# Altium schematic sheet Anolog Input.SchDoc
size A2
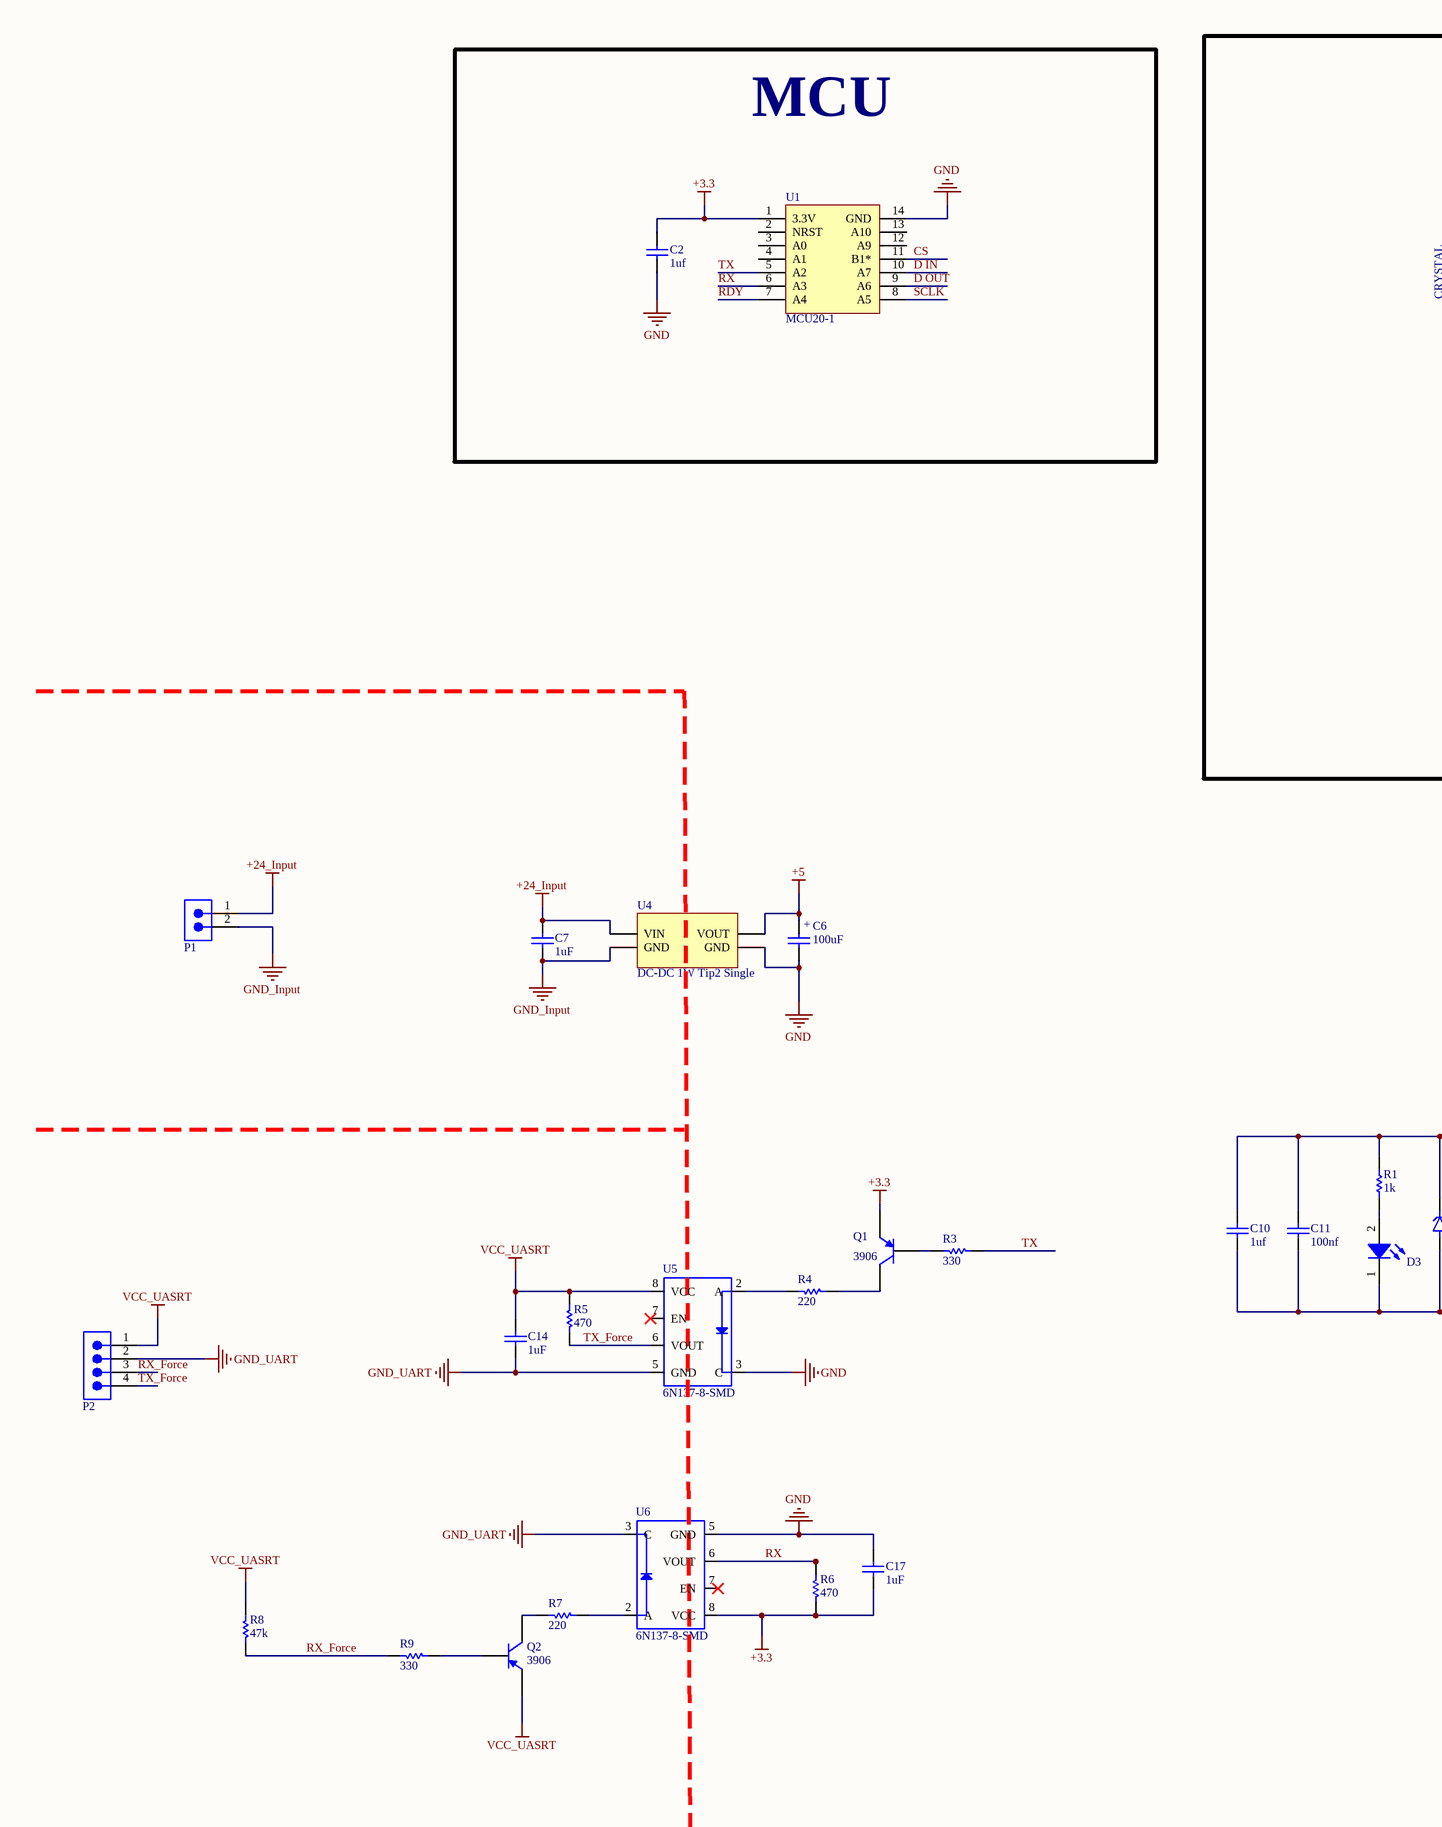
[diagram p0: Anolog Input.SchDoc, left]
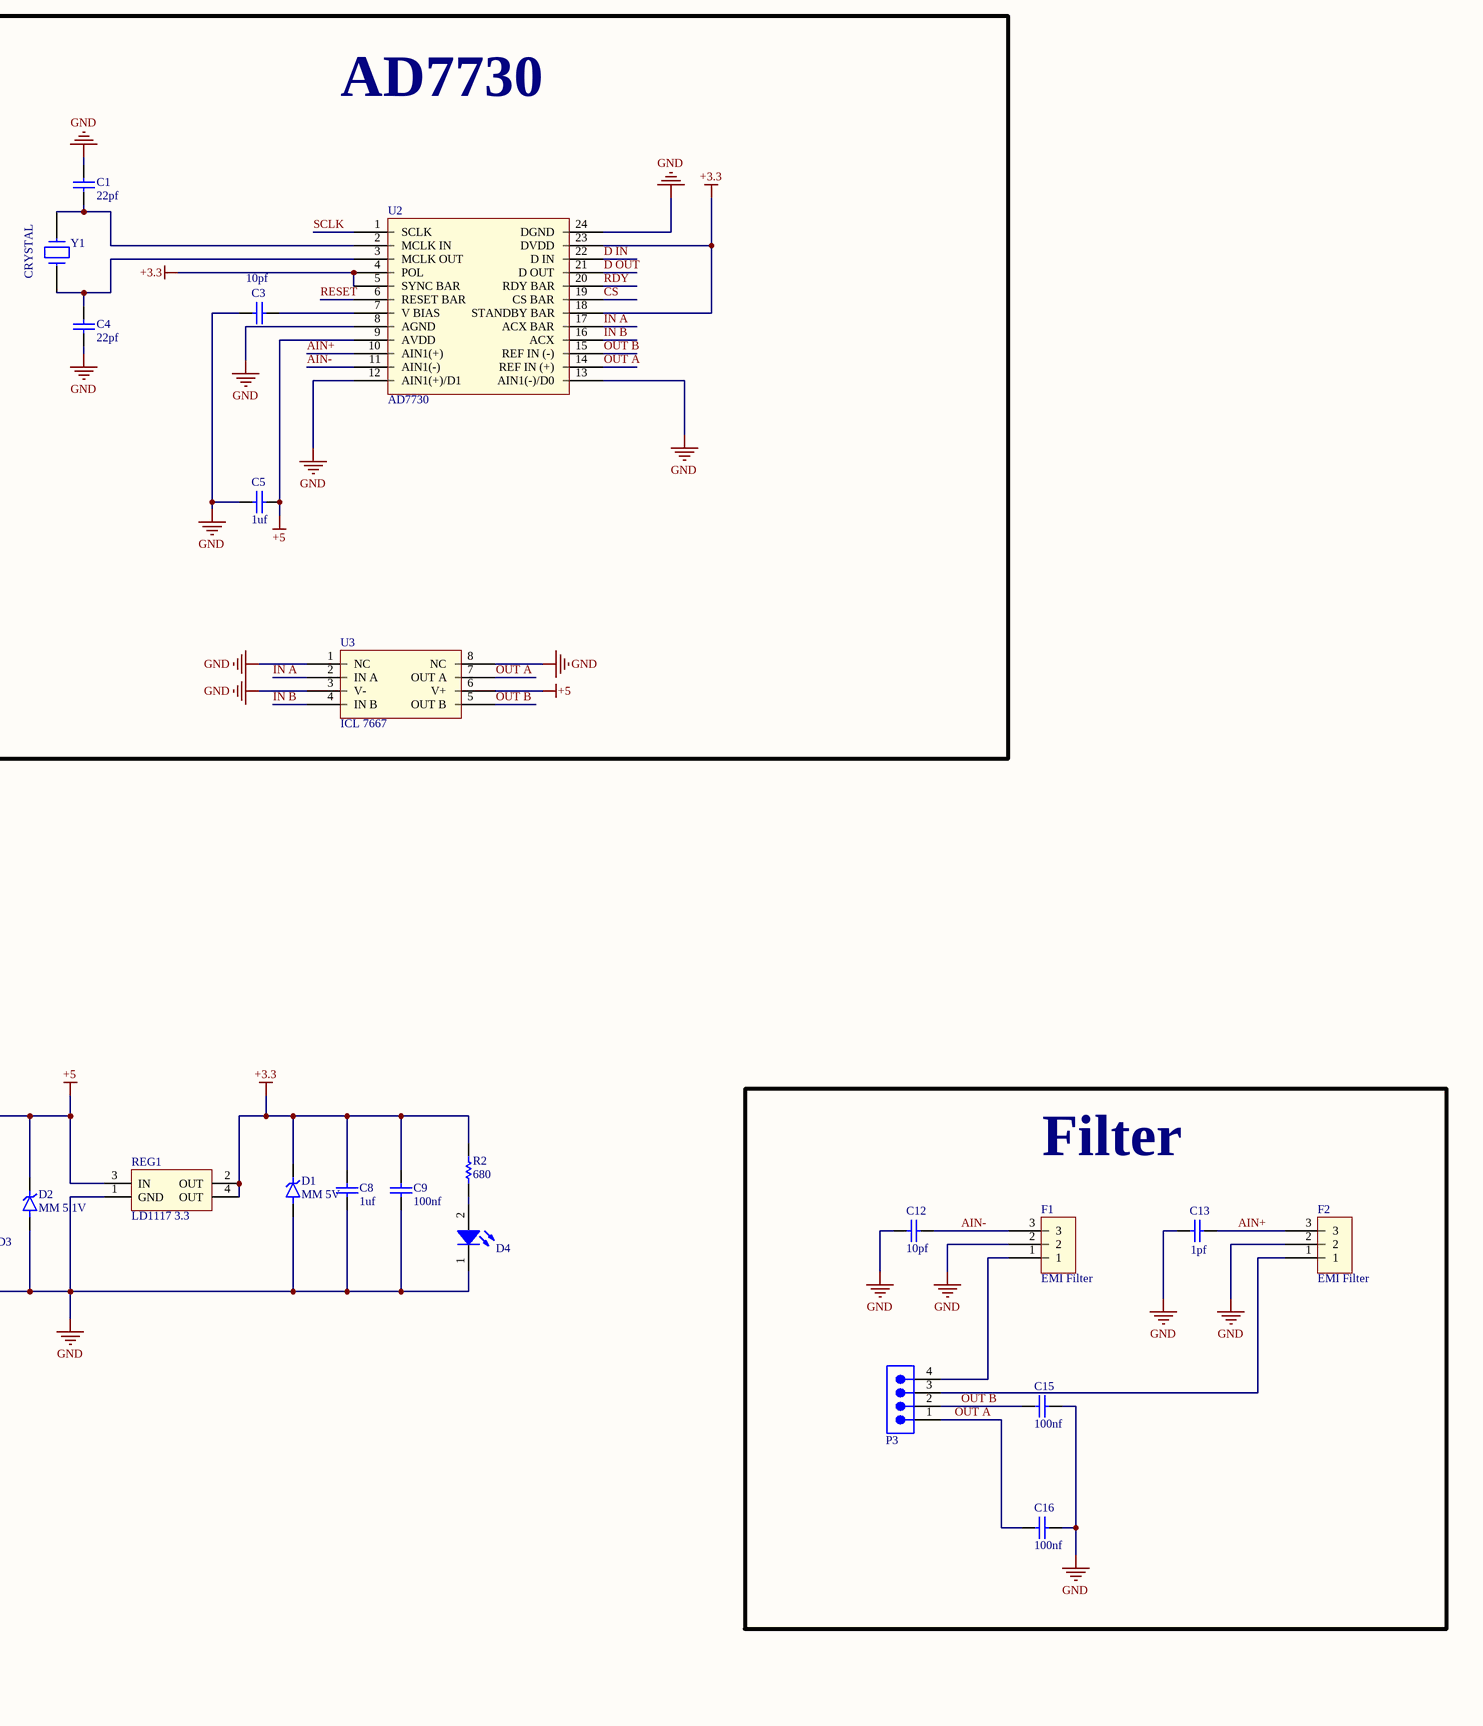
[diagram p1: Anolog Input.SchDoc, right]

## Parts
C1  22pf  [SMD 805 CAP]
C2  1uf  [SMD 805 CAP]
C3  10pf  [SMD 805 CAP]
C4  22pf  [SMD 805 CAP]
C5  1uf  [SMD 805 CAP]
C6  100uF  [MY_CAP_POL 6MM]
C7  1uF  [SMD 805 CAP]
C8  1uf  [SMD 805 CAP]
C9  100nf  [SMD 805 CAP]
C10  1uf  [SMD 805 CAP]
C11  100nf  [SMD 805 CAP]
C12  10pf  [SMD 805 CAP]
C13  1pf  [SMD 805 CAP]
C14  1uF  [SMD 805 CAP]
C15  100nf  [SMD 805 CAP]
C16  100nf  [SMD 805 CAP]
C17  1uF  [SMD 805 CAP]
D1  MM 5V  [MiniMelf]
D2  MM 5.1V  [MiniMelf]
D3  LED_SMD_0805  [LED_0805]  (value not drawn)
D4  LED_SMD_0805  [LED_0805]  (value not drawn)
F1  EMI Filter  [EMI FILTER]
F2  EMI Filter  [EMI FILTER]
P1  691312510002  [691312510002]  (value not drawn)
P2  691312510004  [691312510004]  (value not drawn)
P3  61300411121  [61300411121]  (value not drawn)
Q1  3906  [MY_SMD_TRANSISTOR]
Q2  3906  [MY_SMD_TRANSISTOR]
R1  1k  [SMD 805]
R2  680  [SMD 805]
R3  330  [SMD 805]
R4  220  [SMD 805]
R5  470  [SMD 805]
R6  470  [SMD 805]
R7  220  [SMD 805]
R8  47k  [SMD 805]
R9  330  [SMD 805]
REG1  LD1117 3.3  [MY_LD1117-3.3]
U1  MCU20-1  [MCU20-1]
U2  AD7730  [PDIP 24]
U3  ICL 7667  [SOIC 8]
U4  DC-DC 1W Tip2 Single  [DC-DC-1W-Tip2]
U5  6N137-8-SMD  [6N137-8-SMD]
U6  6N137-8-SMD  [6N137-8-SMD]
Y1  CRYSTAL  [My_Crystal]

## Blocks framed on the sheet
MCU: C2 U1
AD7730: C1 C3-C5 U2 U3 Y1
Filter: C12 C13 C15 C16 F1 F2 P3

## Nets
+3.3: C2.1 C8.2 C9.2 C17.2 D1.2 Q1.E R2.2 R6.2 REG1.2(OUT) REG1.4(OUT) U1.1(3.3V) U2.4(POL) U2.5(SYNC_BAR) U2.18(STANDBY_BAR) U2.23(DVDD) U6.8(VCC)
+5: C5.1 C6.+ C10.2 C11.2 D2.2 R1.2 REG1.3(IN) U2.9(AVDD) U3.6(V+) U4.7(VOUT)
+24_Input: C7.2 P1.1 U4.1(VIN)
GND: C1.1 C2.2 C3.2 C4.2 C5.2 C6.- C8.1 C9.1 C10.1 C11.1 C12.1 C13.1 C15.1 C16.1 C17.1 D1.1 D2.1 D3.1(K) D4.1(K) F1.2 F2.2 REG1.1(GND) U1.14(GND) U2.8(AGND) U2.12(AIN1(+)/D1) U2.13(AIN1(-)/D0) U2.24(DGND) U3.1(NC) U3.3(V-) U3.8(NC) U4.5(GND) U5.3(C) U6.5(GND)
GND_Input: C7.1 P1.2 U4.2(GND)
GND_UART: C14.1 P2.2 U5.5(GND) U6.3(C)
VCC_UASRT: C14.2 P2.1 Q2.E R5.2 R8.2 U5.8(VCC)
AIN+: C13.2 F2.3 U2.10(AIN1(+))
AIN-: C12.2 F1.3 U2.11(AIN1(-))
CS: U1.11(B1*) U2.19(CS_BAR)
D IN: U1.10(A7) U2.22(D_IN)
D OUT: U1.9(A6) U2.21(D_OUT)
IN A: U2.17(ACX_BAR) U3.2(IN_A)
IN B: U2.16(ACX) U3.4(IN_B)
OUT A: C16.2 P3.1 U2.14(REF_IN_(+)) U3.7(OUT_A)
OUT B: C15.2 P3.2 U2.15(REF_IN_(-)) U3.5(OUT_B)
RDY: U1.7(A4) U2.20(RDY_BAR)
RESET: U2.6(RESET_BAR)
RX: R6.1 U1.6(A3) U6.6(VOUT)
RX_Force: P2.3 R8.1 R9.2
SCLK: U1.8(A5) U2.1(SCLK)
TX: R3.1 U1.5(A2)
TX_Force: P2.4 R5.1 U5.6(VOUT)
NetC1_2: C1.2 U2.2(MCLK_IN) Y1.1
NetC3_1: C3.1 U2.7(V_BIAS)
NetC4_1: C4.1 U2.3(MCLK_OUT) Y1.2
NetD3_2: D3.2(A) R1.1
NetD4_2: D4.2(A) R2.1
NetF1_1: F1.1 P3.4
NetF2_1: F2.1 P3.3
NetQ1_B: Q1.B R3.2
NetQ1_C: Q1.C R4.1
NetQ2_B: Q2.B R9.1
NetQ2_C: Q2.C R7.2
NetR4_2: R4.2 U5.2(A)
NetR7_1: R7.1 U6.2(A)

Not connected (* = marked no-connect by the designer): U1 2(NRST) 3(A0) 4(A1) 12(A9) 13(A10); U5 7(EN)*; U6 7(EN)*

## Library data of the parts
C1 C4 = CAP B: 1uf
C2 C3 C5 C7-C17 = CAP B
C6 = Cap Pol_6mm: CAP-3300Uf
D1 D2 = MiniMelf_500mW: MP: ZM4736A_L0; Package: None; Availability: Unavailable; Price: None; Value: *
P1 = 691312510002: WR-TBL Series 312 Open Horizontal PCB Header, THT, pitch 5.08mm, 2p; Manufacturer: Wurth Elektronik; Modularity: No; Rated Current: 20A; Working Voltage: 300V; ComponentLink1Description: Website Link; ComponentLink1URL: https://www.we-online.com/redexpert/article/691312510002?ad; ComponentLink2Description: Datasheet Link; ComponentLink2URL: https://www.we-online.com/redexpert/spec/691312510002?ad; Manufacturer Part Number: 691312510002; Category: Terminal Blocks; Match Code: WR-TBL; Mount: Through Hole; Operating Temperature Max: 105°C; Operating Temperature Min: -40°C; Packaging: Box; Application: Pluggable; Number of Pins: 2; Number of Rows: 1; Orientation: Horizontal; Pitch: 5.08mm
P2 = 691312510004: WR-TBL Series 312 Open Horizontal PCB Header, THT, pitch 5.08mm, 4p; Manufacturer: Wurth Elektronik; Modularity: No; Rated Current: 20A; Working Voltage: 300V; ComponentLink1Description: Website Link; ComponentLink1URL: https://www.we-online.com/redexpert/article/691312510004?ad; ComponentLink2Description: Datasheet Link; ComponentLink2URL: https://www.we-online.com/redexpert/spec/691312510004?ad; Manufacturer Part Number: 691312510004; Category: Terminal Blocks; Match Code: WR-TBL; Mount: Through Hole; Operating Temperature Max: 105°C; Operating Temperature Min: -40°C; Packaging: Box; Application: Pluggable; Number of Pins: 4; Number of Rows: 1; Orientation: Horizontal; Pitch: 5.08mm
P3 = 61300411121: WR-PHD Pin Header, THT, Vertical, pitch 2.54mm, 1 Row, 4P; Manufacturer: Wurth Elektronik; Contact Resistance: 20mΩ; Rated Current: 3A; Working Voltage: 250V; Withstanding Voltage: 500V; ComponentLink1Description: Website Link; ComponentLink1URL: https://www.we-online.com/redexpert/article/61300411121?ad; ComponentLink2Description: Datasheet Link; ComponentLink2URL: https://www.we-online.com/redexpert/spec/61300411121?ad; Manufacturer Part Number: 61300411121; Category: Board-to-Board Connectors; Match Code: WR-PHD; Mount: Through Hole; Operating Temperature Max: 105°C; Operating Temperature Min: -40°C; Packaging: Bag; Gender: Pin Header; Number of Pins: 4; Number of Rows: 1; Orientation: Vertical; Pitch: 2.54mm
Q1 Q2 = 3906 SMD TRANSISTOR: PNP 60V 625mW IC=200mA
R1-R9 = Resistor